# EAGLE design 8 channel relay module (EAGLE 7.5.0)
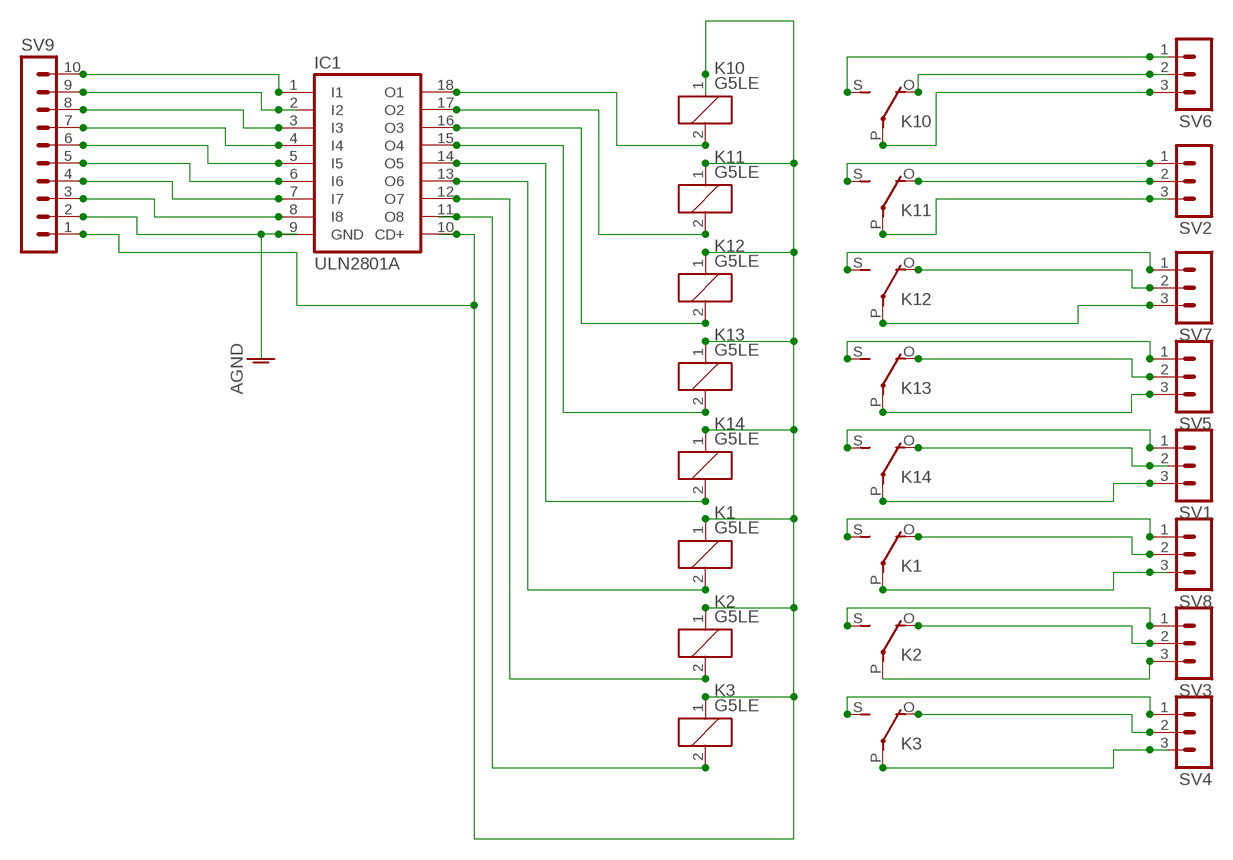
[diagram p0: schematic, sheet 1]

## Parts
IC1  ULN2801A  [DIL18]
K1  G5LE  [G5LE]
K2  G5LE  [G5LE]
K3  G5LE  [G5LE]
K10  G5LE  [G5LE]
K11  G5LE  [G5LE]
K12  G5LE  [G5LE]
K13  G5LE  [G5LE]
K14  G5LE  [G5LE]
SV1  MA03-1  [MA03-1]
SV2  MA03-1  [MA03-1]
SV3  MA03-1  [MA03-1]
SV4  MA03-1  [MA03-1]
SV5  MA03-1  [MA03-1]
SV6  MA03-1  [MA03-1]
SV7  MA03-1  [MA03-1]
SV8  MA03-1  [MA03-1]
SV9  MA10-1  [MA10-1]

## Nets
N$1: IC1.18(O1) K10.2
N$2: IC1.17(O2) K11.2
N$3: IC1.16(O3) K12.2
N$4: IC1.15(O4) K13.2
N$5: IC1.14(O5) K14.2
N$6: IC1.13(O6) K1.2
N$7: IC1.12(O7) K2.2
N$8: IC1.11(O8) K3.2
N$9: IC1.10(CD+) K1.1 K2.1 K3.1 K10.1 K11.1 K12.1 K13.1 K14.1 SV9.1
N$10: K10.S(2:S) SV6.1
N$11: K10.P(2:P) SV6.3
N$12: K10.O(2:O) SV6.2
N$13: K11.S(2:S) SV2.1
N$14: K11.O(2:O) SV2.2
N$15: K11.P(2:P) SV2.3
N$16: K12.S(2:S) SV7.1
N$17: IC1.1(I1) SV9.10
N$18: K12.O(2:O) SV7.2
N$19: K12.P(2:P) SV7.3
N$20: K13.S(2:S) SV5.1
N$21: K13.O(2:O) SV5.2
N$22: K13.P(2:P) SV5.3
N$23: K14.S(2:S) SV1.1
N$24: K14.O(2:O) SV1.2
N$25: K14.P(2:P) SV1.3
N$26: K1.S(2:S) SV8.1
N$27: K1.O(2:O) SV8.2
N$28: K1.P(2:P) SV8.3
N$29: K2.S(2:S) SV3.1
N$30: K2.O(2:O) SV3.2
N$31: K2.P(2:P) SV3.3
N$33: K3.S(2:S) SV4.1
N$34: IC1.2(I2) SV9.9
N$35: IC1.3(I3) SV9.8
N$36: IC1.4(I4) SV9.7
N$37: IC1.5(I5) SV9.6
N$38: IC1.6(I6) SV9.5
N$39: IC1.7(I7) SV9.4
N$40: IC1.8(I8) SV9.3
N$41: IC1.9(GND) SV9.2
N$42: K3.O(2:O) SV4.2
N$43: K3.P(2:P) SV4.3

## Library data of the parts
IC1 = uln-udn:ULN2801A: DRIVER ARRAY
K1-K3 K10-K14 = relay:G5LE: RELAY 1 x switch, 10 A/120 V AC, 8 A/30 V DC, Omron; OC_FARNELL: unknown; OC_NEWARK: unknown
SV1-SV8 = con-lstb:MA03-1: PIN HEADER; OC_FARNELL: unknown; OC_NEWARK: unknown
SV9 = con-lstb:MA10-1: PIN HEADER; OC_FARNELL: unknown; OC_NEWARK: unknown

## Net classes
0 default: width 0.203 mm, drill 0.203 mm, clearance 0.203 mm

## Board
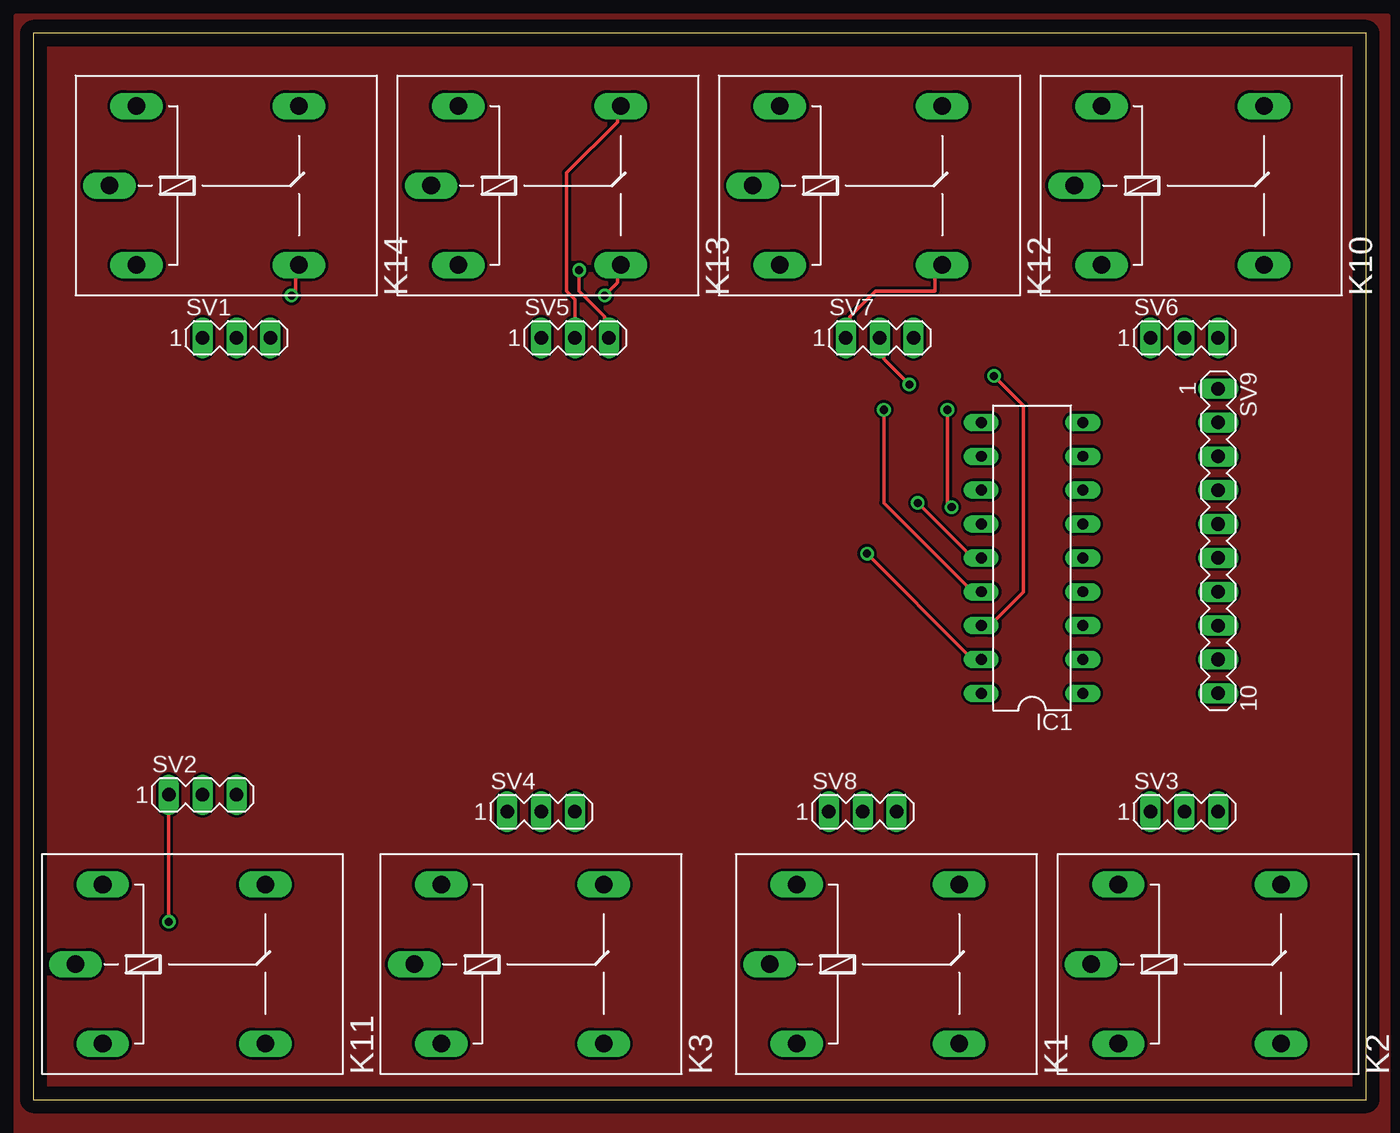
[diagram p1: board, top side]
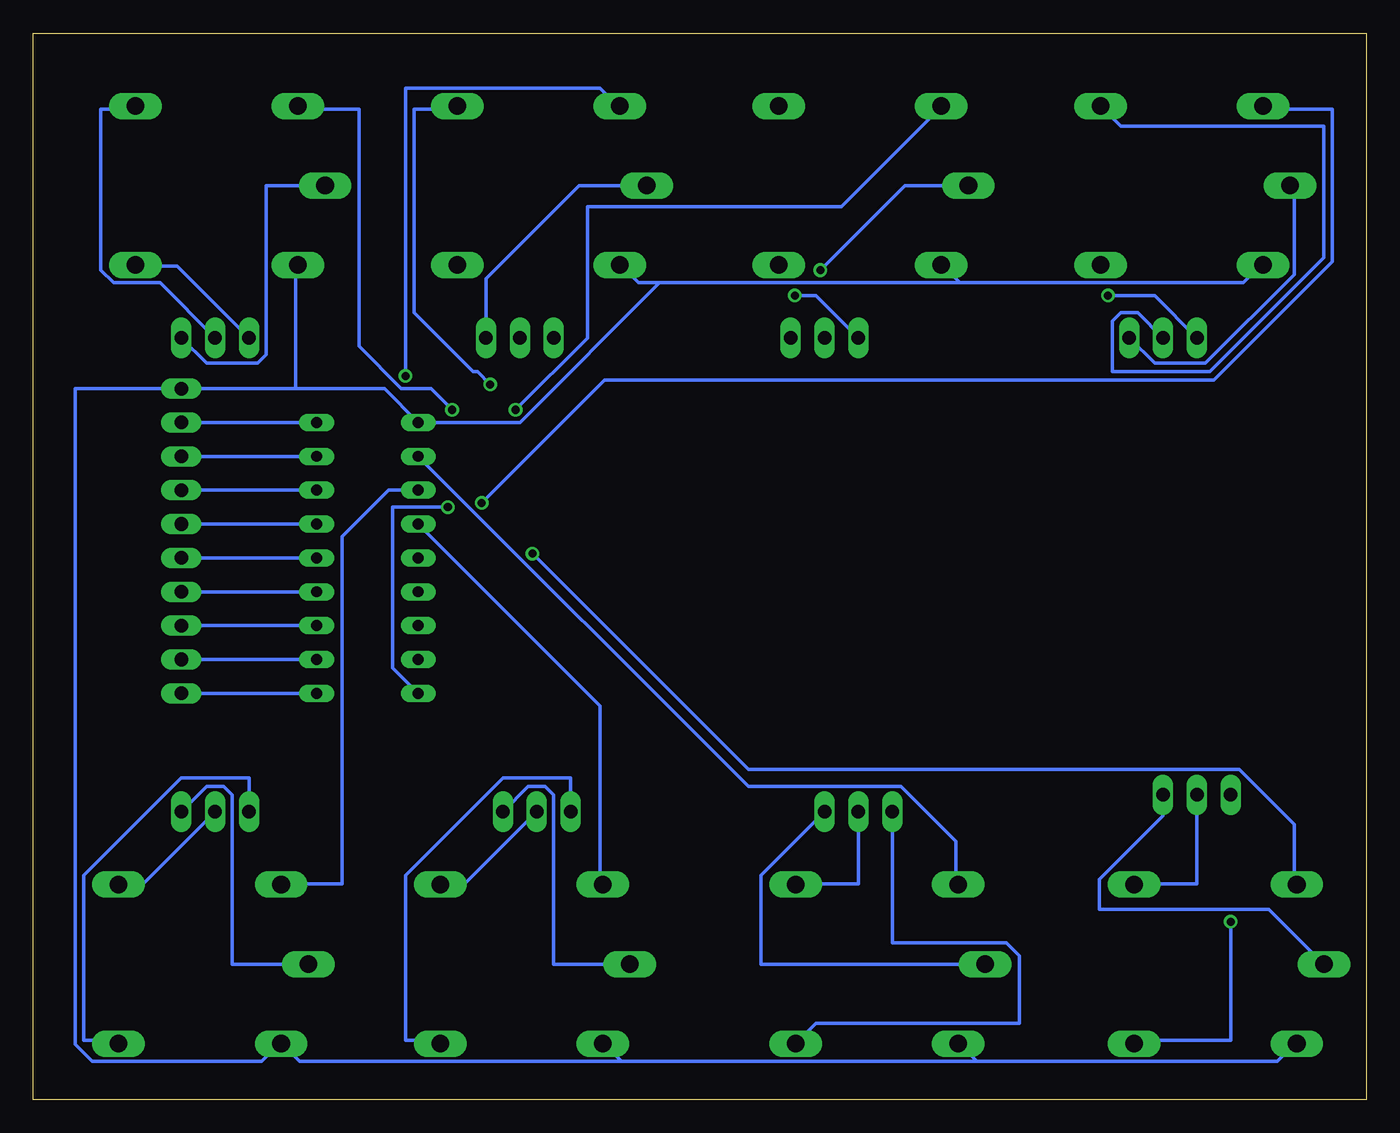
[diagram p2: board, bottom side, seen from below]

Size 100 x 80 mm. Coordinates in mm from the lower left corner, seen from the top.
Outline: 0,0 100,0 100,80 0,80 0,0
Copper layers (1*16): Top 0.035mm / dielectric 1.5mm / Bottom 0.035mm
Design rules "default": minimum track width 10mil, minimum drill 24mil, track to track 8mil, track to pad 8mil, pad to pad 8mil, via to via 8mil, smd to smd 8mil, copper to edge 40mil, drill to drill 8mil, minimum pad ring 10mil, minimum via ring 8mil, stop-mask expansion 4mil, vias tented up to drill 0mil, thermal gap 10mil

### Footprints (pad centres in the part's own frame; a part is rotated, then mirrored left to right if it is on the bottom)
DIL18 = drill 0.813 long: 1 -10.16,-3.81; 2 -7.62,-3.81; 3 -5.08,-3.81; 4 -2.54,-3.81; 5 0,-3.81; 6 2.54,-3.81; 7 5.08,-3.81; 8 7.62,-3.81; 9 10.16,-3.81; 10 10.16,3.81; 11 7.62,3.81; 12 5.08,3.81; 13 2.54,3.81; 14 0,3.81; 15 -2.54,3.81; 16 -5.08,3.81; 17 -7.62,3.81; 18 -10.16,3.81
G5LE = drill 1.321 long: 1 -7.493,-5.969; 2 -7.493,5.969; O 4.699,5.969; P -9.525,0; S 4.699,-5.969
MA03-1 = drill 1.016 long: 1 -2.54,0; 2 0,0; 3 2.54,0
MA10-1 = drill 1.016 long: 1 -11.43,0; 2 -8.89,0; 3 -6.35,0; 4 -3.81,0; 5 -1.27,0; 6 1.27,0; 7 3.81,0; 8 6.35,0; 9 8.89,0; 10 11.43,0

### Placement (x,y rotation side)
IC1  74.93,40.64 90 top
K1  64.77,10.16 0 top
K2  88.9,10.16 0 top
K3  38.1,10.16 0 top
K10  87.63,68.58 0 top
K11  12.7,10.16 0 top
K12  63.5,68.58 0 top
K13  39.37,68.58 0 top
K14  15.24,68.58 0 top
SV1  15.24,57.15 0 top
SV2  12.7,22.86 0 top
SV3  86.36,21.59 0 top
SV4  38.1,21.59 0 top
SV5  40.64,57.15 0 top
SV6  86.36,57.15 0 top
SV7  63.5,57.15 0 top
SV8  62.23,21.59 0 top
SV9  88.9,41.91 270 top

### Tracks (layer width: path | path; a pad name or v marks a point on that pad's centre or on a via)
AGND
  pour Top: -1.27,81.28 101.6,81.28 101.6,80.01 101.6,-2.54 -1.27,-2.54 -1.27,-1.27
N$1  (via drill 0.61)
  Top 0.254: v68.9,44.45 68.58,44.77 v68.58,51.75
  Bottom 0.254: IC1.18 73.03,32.38 73.03,44.45 v68.9,44.45 | v68.58,51.75 70.17,53.34 72.39,53.34 75.56,56.52 75.56,74.3 80.01,74.3 K10.2
N$2  (via drill 0.61)
  Top 0.254: IC1.17 70.17,33.02 70.17,33.34 v62.55,40.96
  Bottom 0.254: v62.55,40.96 46.35,24.77 9.53,24.77 5.4,20.64 5.4,16.19 K11.2
N$3  (via drill 0.61)
  Top 0.254: IC1.16 72.07,35.56 72.07,35.88 74.3,38.1 74.3,52.07 v72.07,54.29
  Bottom 0.254: v72.07,54.29 72.07,75.88 57.47,75.88 56.2,74.61 K12.2
N$4  (via drill 0.61)
  Top 0.254: IC1.15 70.17,38.1 70.17,38.42 63.82,44.77 v63.82,51.75
  Bottom 0.254: v63.82,51.75 58.42,57.15 58.42,66.99 39.37,66.99 32.07,74.3 K13.2
N$5  (via drill 0.61)
  Top 0.254: IC1.14 70.17,40.64 70.17,40.96 v66.36,44.77
  Bottom 0.254: v66.36,44.77 57.15,53.98 11.43,53.98 2.54,62.87 2.54,74.3 7.62,74.3 K14.2
N$6
  Bottom 0.254: IC1.13 57.47,29.53 57.47,16.19 K1.2
N$7
  Bottom 0.254: IC1.12 73.34,45.72 76.83,42.23 76.83,16.19 81.28,16.19 K2.2
N$8
  Bottom 0.254: IC1.11 46.35,23.5 34.92,23.5 30.8,19.37 30.8,16.19 K3.2
N$9
  Bottom 0.254: 29.21,2.86 6.67,2.86 5.4,4.13 K11.1 | 29.21,2.86 30.48,4.13 K3.1 | 55.88,2.86 57.15,4.13 K1.1 | 29.21,2.86 55.88,2.86 | 55.88,2.86 80.01,2.86 81.28,4.13 K2.1 81.6,4.13 82.87,2.86 95.57,2.86 96.84,4.13 96.84,53.34 SV9.1 80.33,53.34 | 80.33,53.34 73.66,53.34 IC1.10 63.5,50.8 53.02,61.28 | 80.33,53.34 80.33,62.55 K10.1 | 30.48,61.28 9.21,61.28 7.94,62.55 K14.1 | 30.48,61.28 31.75,62.55 K13.1 | 30.48,61.28 53.02,61.28 | 53.02,61.28 54.61,61.28 55.88,62.55 K12.1
N$10
  Bottom 0.254: SV6.1 89.22,62.55 92.08,62.55 K10.S
N$11
  Bottom 0.254: SV6.3 87,55.24 83.19,55.24 82.55,55.88 82.55,68.58 K10.P
N$12
  Bottom 0.254: SV6.2 90.49,61.28 93.98,61.28 94.93,62.23 94.93,74.3 92.39,74.3 K10.O
N$13  (via drill 0.61)
  Top 0.254: v10.16,13.34 SV2.1
  Bottom 0.254: v10.16,13.34 10.16,4.45 17.14,4.45 K11.S
N$14
  Bottom 0.254: SV2.2 12.7,16.19 17.14,16.19 K11.O
N$15
  Bottom 0.254: SV2.3 15.24,21.27 20,16.51 20,14.29 7.3,14.29 K11.P
N$16
  Top 0.254: SV7.1 61.28,57.47 61.28,58.74 63.18,60.64 67.63,60.64 67.63,62.23 67.94,62.55 K12.S
N$17
  Bottom 0.254: SV9.10 IC1.1
N$18  (via drill 0.61)
  Top 0.254: SV7.2 63.82,56.83 63.82,55.56 v65.72,53.66
  Bottom 0.254: v65.72,53.66 66.67,54.61 66.99,54.61 71.44,59.05 71.44,74.3 68.26,74.3 K12.O
N$19
  Bottom 0.254: SV7.3 66.04,61.59 59.05,68.58 K12.P
N$20  (via drill 0.61)
  Top 0.254: v42.86,60.33 43.81,61.28 43.81,62.55 K13.S
  Bottom 0.254: SV5.1 41.27,60.33 v42.86,60.33
N$21
  Top 0.254: SV5.2 40.64,60.01 40.01,60.64 40.01,69.53 43.81,73.34 43.81,74.3 K13.O
N$22  (via drill 0.61)
  Top 0.254: SV5.3 42.86,57.47 42.86,58.74 40.96,60.64 v40.96,62.23
  Bottom 0.254: v40.96,62.23 34.61,68.58 K13.P
N$23  (via drill 0.61)
  Top 0.254: v19.37,60.33 19.68,60.64 19.68,62.55 K14.S
  Bottom 0.254: SV1.1 15.88,60.33 v19.37,60.33
N$24
  Bottom 0.254: SV1.2 17.14,59.05 18.41,59.05 19.05,58.42 19.05,54.61 11.75,54.61 3.17,63.18 3.17,73.03 18.41,73.03 K14.O
N$25
  Bottom 0.254: SV1.3 15.88,55.24 12.06,55.24 5.4,61.91 5.4,68.58 K14.P
N$26
  Bottom 0.254: SV8.1 59.69,24.13 64.77,24.13 72.07,16.83 72.07,4.45 69.53,4.45 K1.S
N$27
  Bottom 0.254: SV8.2 67.63,16.19 69.22,16.19 K1.O
N$28
  Bottom 0.254: SV8.3 62.87,23.5 61.59,23.5 60.96,22.86 60.96,10.16 K1.P
N$29
  Bottom 0.254: SV3.1 83.82,24.13 88.9,24.13 96.2,16.83 96.2,4.45 93.66,4.45 K2.S
N$30
  Bottom 0.254: SV3.2 91.76,16.19 93.34,16.19 K2.O
N$31
  Bottom 0.254: SV3.3 87,23.5 85.72,23.5 85.09,22.86 85.09,10.16 K2.P
N$33
  Bottom 0.254: SV4.1 35.56,11.75 26.99,11.75 26.04,10.79 26.04,5.71 41.27,5.71 K3.S
N$34
  Bottom 0.254: SV9.9 IC1.2
N$35
  Bottom 0.254: SV9.8 IC1.3
N$36
  Bottom 0.254: SV9.7 IC1.4
N$37
  Bottom 0.254: SV9.6 IC1.5
N$38
  Bottom 0.254: SV9.5 IC1.6
N$39
  Bottom 0.254: SV9.4 IC1.7
N$40
  Bottom 0.254: SV9.3 IC1.8
N$41
  Bottom 0.254: SV9.2 IC1.9
N$42
  Bottom 0.254: SV4.2 38.1,16.19 42.55,16.19 K3.O
N$43
  Bottom 0.254: SV4.3 45.4,16.83 45.4,10.16 K3.P